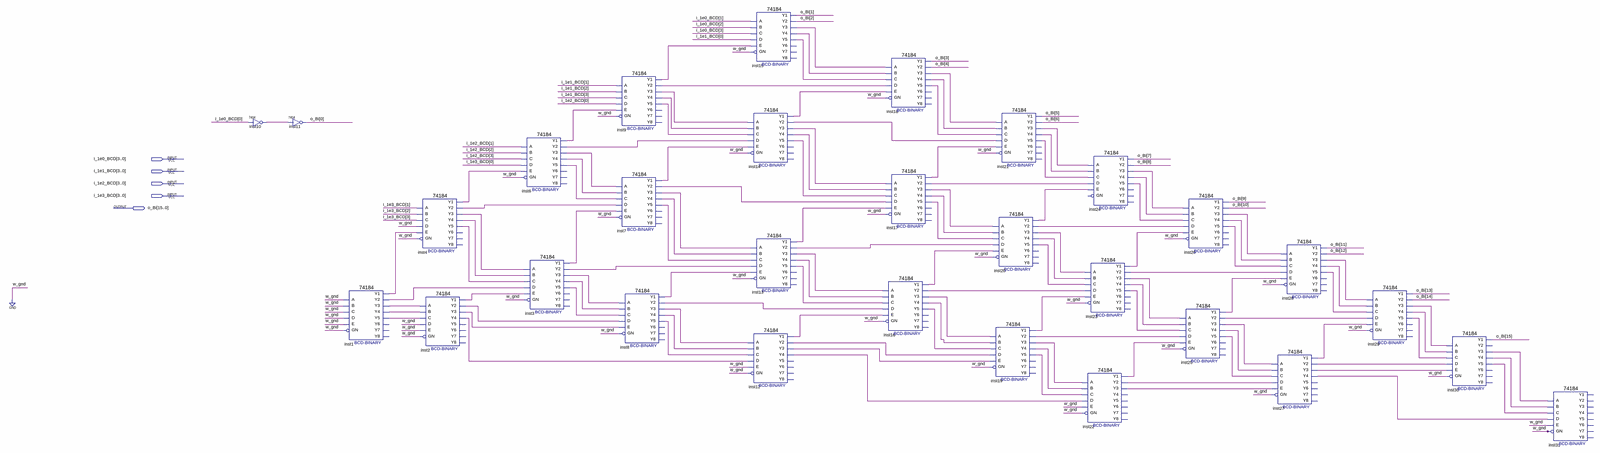
[diagram p0: schematic sheet, whole]
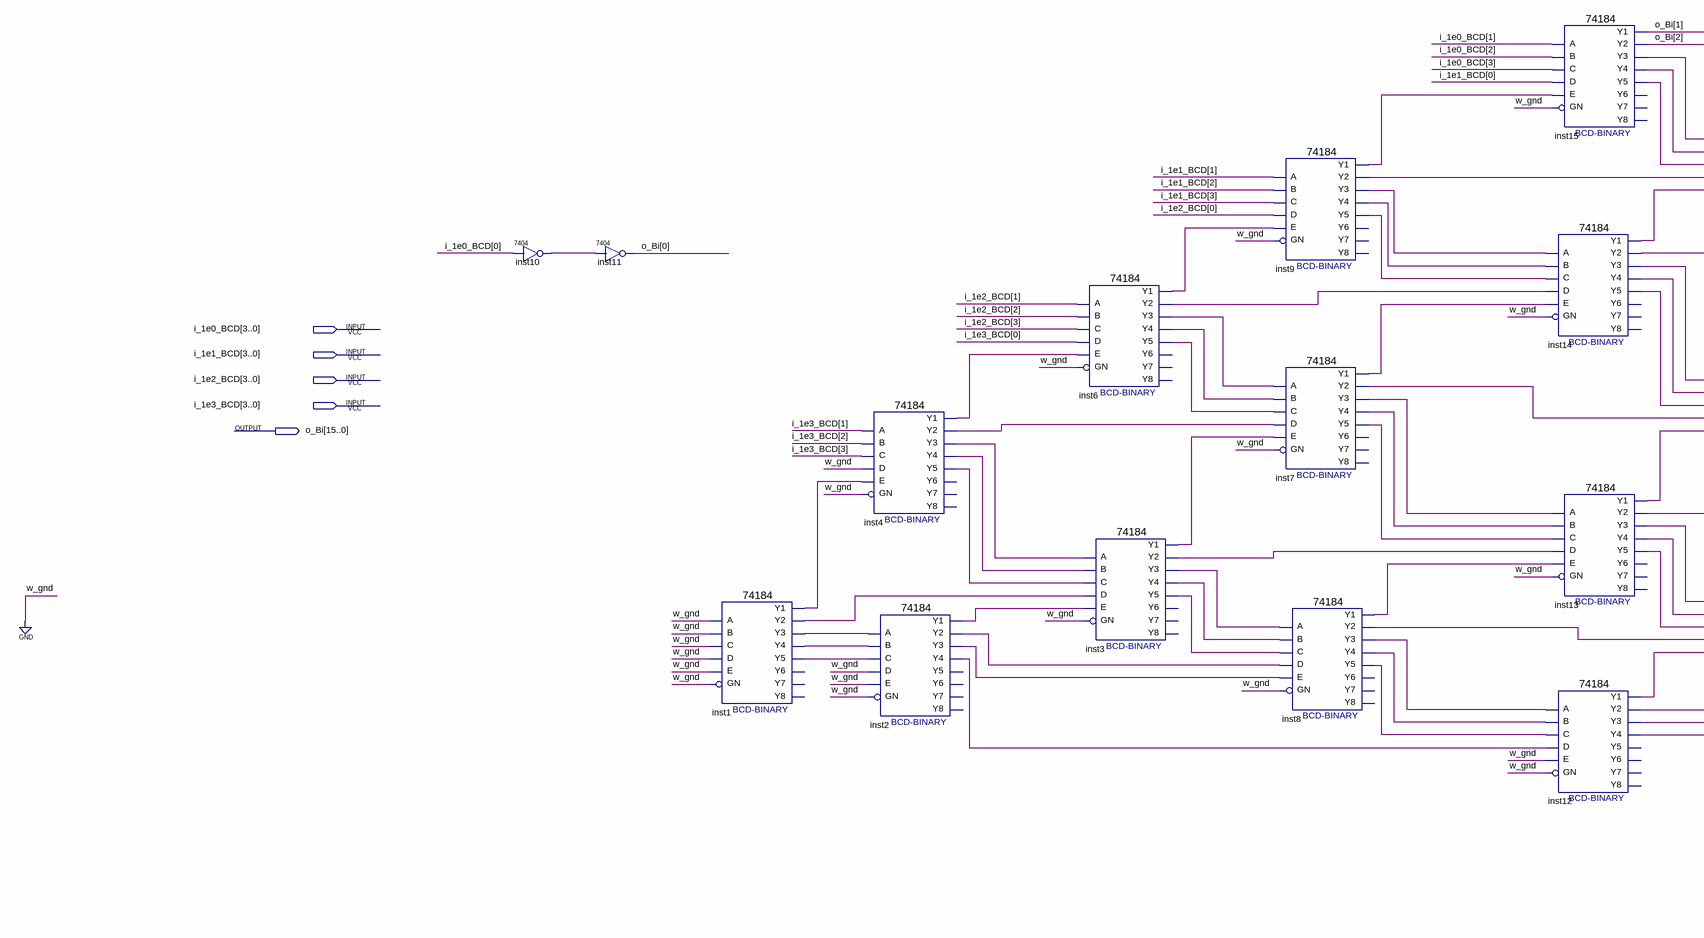
[diagram p1: schematic sheet, left part]
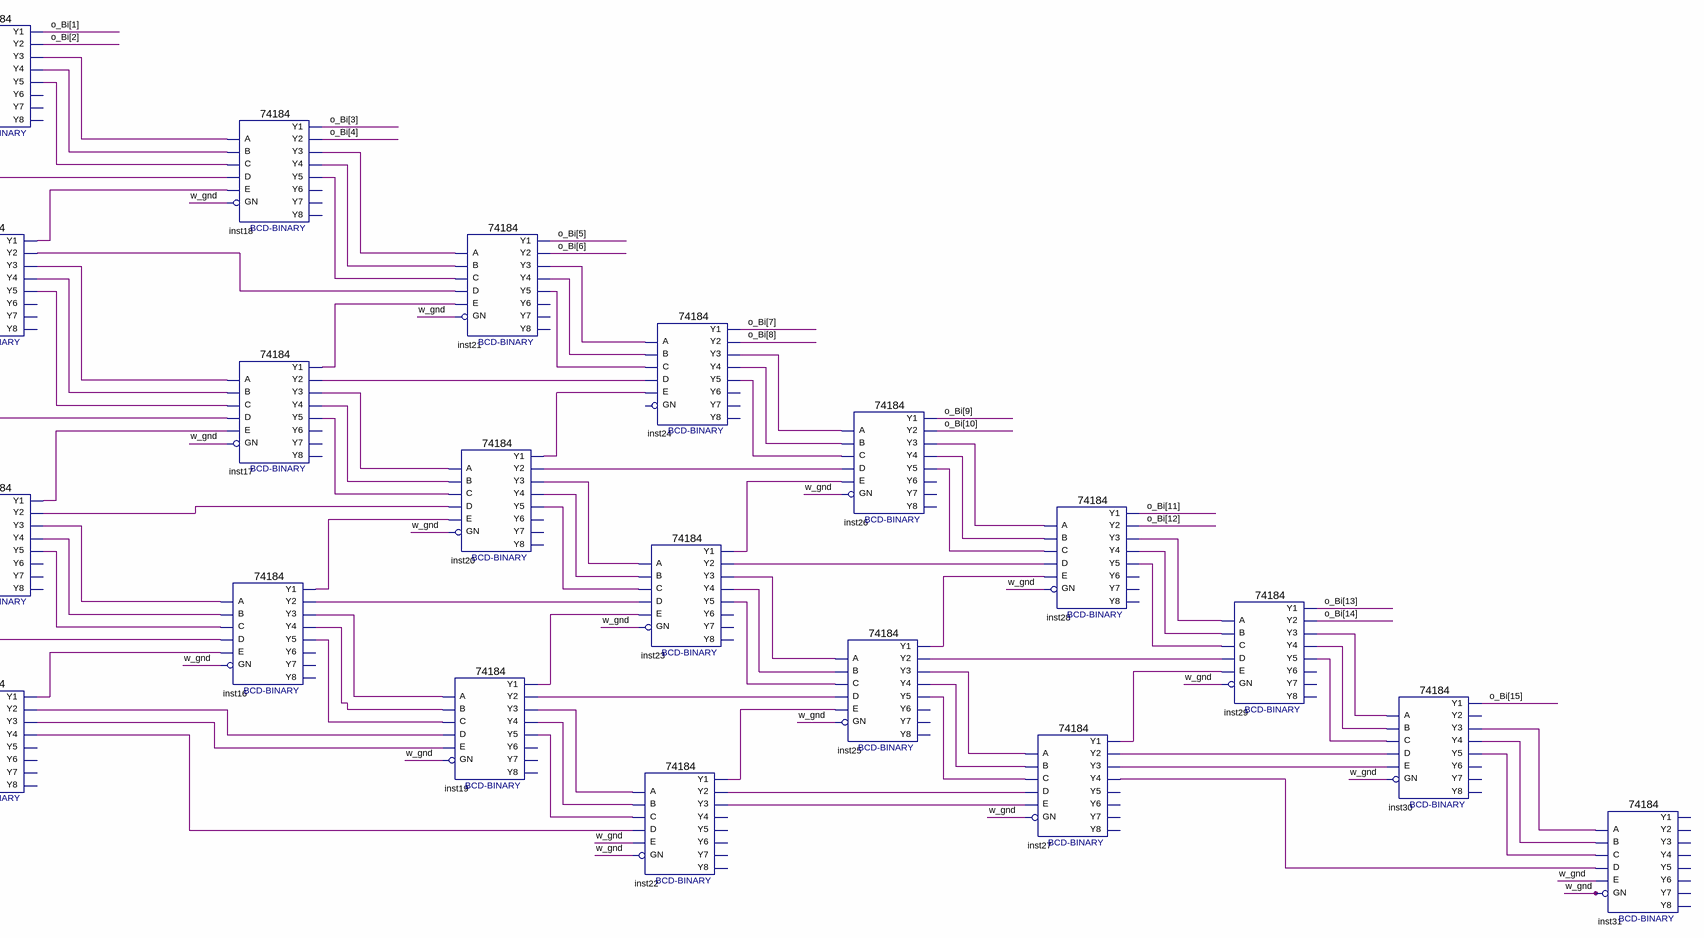
[diagram p2: schematic sheet, right part]
// Quartus schematic bcd_to_binary_1000.bdf as structural Verilog: 30 symbols, 5 pins
module bcd_to_binary_1000 (
  input  [3:0] i_1e0_BCD,
  input  [3:0] i_1e1_BCD,
  input  [3:0] i_1e2_BCD,
  input  [3:0] i_1e3_BCD,
  output [15:0] o_Bi
);

  wire inst1_y1, inst1_y2, inst1_y3, inst1_y4, inst1_y5, inst2_y1, inst2_y2, inst2_y3, inst2_y4, inst3_y1,
       inst3_y2, inst3_y3, inst3_y4, inst3_y5, inst4_y1, inst4_y2, inst4_y3, inst4_y4, inst4_y5, inst6_y1,
       inst6_y2, inst6_y3, inst6_y4, inst6_y5, inst7_y1, inst7_y2, inst7_y3, inst7_y4, inst7_y5, inst8_y1,
       inst8_y2, inst8_y3, inst8_y4, inst8_y5, inst9_y1, inst9_y2, inst9_y3, inst9_y4, inst9_y5, inst10_1,
       inst12_y1, inst12_y2, inst12_y3, inst12_y4, inst13_y1, inst13_y2, inst13_y3, inst13_y4, inst13_y5,
       inst14_y1, inst14_y2, inst14_y3, inst14_y4, inst14_y5, inst15_y3, inst15_y4, inst15_y5, inst16_y1,
       inst16_y2, inst16_y3, inst16_y4, inst16_y5, inst17_y1, inst17_y2, inst17_y3, inst17_y4, inst17_y5,
       inst18_y3, inst18_y4, inst18_y5, inst19_y1, inst19_y2, inst19_y3, inst19_y4, inst19_y5, inst20_y1,
       inst20_y2, inst20_y3, inst20_y4, inst20_y5, inst21_y3, inst21_y4, inst21_y5, inst22_y1, inst22_y2,
       inst22_y3, inst23_y1, inst23_y2, inst23_y3, inst23_y4, inst23_y5, inst24_y3, inst24_y4, inst24_y5,
       inst25_y1, inst25_y2, inst25_y3, inst25_y4, inst25_y5, inst26_y3, inst26_y4, inst26_y5, inst27_y1,
       inst27_y2, inst27_y3, inst27_y4, inst28_y3, inst28_y4, inst28_y5, inst29_y3, inst29_y4, inst29_y5,
       inst30_y3, inst30_y4, inst30_y5;

  \7404  inst10 (.\2 (i_1e0_BCD[0]), .\1 (inst10_1));
  \7404  inst11 (.\2 (inst10_1), .\1 (o_Bi[0]));
  \74184  inst1 (
    .D(1'b0), .A(1'b0), .B(1'b0), .C(1'b0), .E(1'b0), .GN(1'b0), .Y5(inst1_y5), .Y3(inst1_y3), .Y4(inst1_y4),
    .Y2(inst1_y2), .Y1(inst1_y1));  // open: Y6, Y7, Y8
  \74184  inst4 (
    .D(1'b0), .A(i_1e3_BCD[1]), .B(i_1e3_BCD[2]), .C(i_1e3_BCD[3]), .E(inst1_y1), .GN(1'b0), .Y5(inst4_y5),
    .Y3(inst4_y3), .Y4(inst4_y4), .Y2(inst4_y2), .Y1(inst4_y1));  // open: Y6, Y7, Y8
  \74184  inst2 (
    .D(1'b0), .A(inst1_y3), .B(inst1_y4), .C(inst1_y5), .E(1'b0), .GN(1'b0), .Y3(inst2_y3), .Y4(inst2_y4),
    .Y2(inst2_y2), .Y1(inst2_y1));  // open: Y5, Y6, Y7, Y8
  \74184  inst6 (
    .D(i_1e3_BCD[0]), .A(i_1e2_BCD[1]), .B(i_1e2_BCD[2]), .C(i_1e2_BCD[3]), .E(inst4_y1), .GN(1'b0),
    .Y5(inst6_y5), .Y3(inst6_y3), .Y4(inst6_y4), .Y2(inst6_y2), .Y1(inst6_y1));  // open: Y6, Y7, Y8
  \74184  inst3 (
    .D(inst1_y2), .A(inst4_y3), .B(inst4_y4), .C(inst4_y5), .E(inst2_y1), .GN(1'b0), .Y5(inst3_y5),
    .Y3(inst3_y3), .Y4(inst3_y4), .Y2(inst3_y2), .Y1(inst3_y1));  // open: Y6, Y7, Y8
  \74184  inst9 (
    .D(i_1e2_BCD[0]), .A(i_1e1_BCD[1]), .B(i_1e1_BCD[2]), .C(i_1e1_BCD[3]), .E(inst6_y1), .GN(1'b0),
    .Y5(inst9_y5), .Y3(inst9_y3), .Y4(inst9_y4), .Y2(inst9_y2), .Y1(inst9_y1));  // open: Y6, Y7, Y8
  \74184  inst7 (
    .D(inst4_y2), .A(inst6_y3), .B(inst6_y4), .C(inst6_y5), .E(inst3_y1), .GN(1'b0), .Y5(inst7_y5),
    .Y3(inst7_y3), .Y4(inst7_y4), .Y2(inst7_y2), .Y1(inst7_y1));  // open: Y6, Y7, Y8
  \74184  inst8 (
    .D(inst2_y2), .A(inst3_y3), .B(inst3_y4), .C(inst3_y5), .E(inst2_y3), .GN(1'b0), .Y5(inst8_y5),
    .Y3(inst8_y3), .Y4(inst8_y4), .Y2(inst8_y2), .Y1(inst8_y1));  // open: Y6, Y7, Y8
  \74184  inst15 (
    .D(i_1e1_BCD[0]), .A(i_1e0_BCD[1]), .B(i_1e0_BCD[2]), .C(i_1e0_BCD[3]), .E(inst9_y1), .GN(1'b0),
    .Y5(inst15_y5), .Y3(inst15_y3), .Y4(inst15_y4), .Y2(o_Bi[2]), .Y1(o_Bi[1]));  // open: Y6, Y7, Y8
  \74184  inst14 (
    .D(inst6_y2), .A(inst9_y3), .B(inst9_y4), .C(inst9_y5), .E(inst7_y1), .GN(1'b0), .Y5(inst14_y5),
    .Y3(inst14_y3), .Y4(inst14_y4), .Y2(inst14_y2), .Y1(inst14_y1));  // open: Y6, Y7, Y8
  \74184  inst13 (
    .D(inst3_y2), .A(inst7_y3), .B(inst7_y4), .C(inst7_y5), .E(inst8_y1), .GN(1'b0), .Y5(inst13_y5),
    .Y3(inst13_y3), .Y4(inst13_y4), .Y2(inst13_y2), .Y1(inst13_y1));  // open: Y6, Y7, Y8
  \74184  inst12 (
    .D(inst2_y4), .A(inst8_y3), .B(inst8_y4), .C(inst8_y5), .E(1'b0), .GN(1'b0), .Y3(inst12_y3),
    .Y4(inst12_y4), .Y2(inst12_y2), .Y1(inst12_y1));  // open: Y5, Y6, Y7, Y8
  \74184  inst18 (
    .D(inst9_y2), .A(inst15_y3), .B(inst15_y4), .C(inst15_y5), .E(inst14_y1), .GN(1'b0), .Y5(inst18_y5),
    .Y3(inst18_y3), .Y4(inst18_y4), .Y2(o_Bi[4]), .Y1(o_Bi[3]));  // open: Y6, Y7, Y8
  \74184  inst17 (
    .D(inst7_y2), .A(inst14_y3), .B(inst14_y4), .C(inst14_y5), .E(inst13_y1), .GN(1'b0), .Y5(inst17_y5),
    .Y3(inst17_y3), .Y4(inst17_y4), .Y2(inst17_y2), .Y1(inst17_y1));  // open: Y6, Y7, Y8
  \74184  inst16 (
    .D(inst8_y2), .A(inst13_y3), .B(inst13_y4), .C(inst13_y5), .E(inst12_y1), .GN(1'b0), .Y5(inst16_y5),
    .Y3(inst16_y3), .Y4(inst16_y4), .Y2(inst16_y2), .Y1(inst16_y1));  // open: Y6, Y7, Y8
  \74184  inst21 (
    .D(inst14_y2), .A(inst18_y3), .B(inst18_y4), .C(inst18_y5), .E(inst17_y1), .GN(1'b0), .Y5(inst21_y5),
    .Y3(inst21_y3), .Y4(inst21_y4), .Y2(o_Bi[6]), .Y1(o_Bi[5]));  // open: Y6, Y7, Y8
  \74184  inst20 (
    .D(inst13_y2), .A(inst17_y3), .B(inst17_y4), .C(inst17_y5), .E(inst16_y1), .GN(1'b0), .Y5(inst20_y5),
    .Y3(inst20_y3), .Y4(inst20_y4), .Y2(inst20_y2), .Y1(inst20_y1));  // open: Y6, Y7, Y8
  \74184  inst19 (
    .D(inst12_y2), .A(inst16_y3), .B(inst16_y4), .C(inst16_y5), .E(inst12_y3), .GN(1'b0), .Y5(inst19_y5),
    .Y3(inst19_y3), .Y4(inst19_y4), .Y2(inst19_y2), .Y1(inst19_y1));  // open: Y6, Y7, Y8
  \74184  inst24 (
    .D(inst17_y2), .A(inst21_y3), .B(inst21_y4), .C(inst21_y5), .E(inst20_y1), .Y5(inst24_y5),
    .Y3(inst24_y3), .Y4(inst24_y4), .Y2(o_Bi[8]), .Y1(o_Bi[7]));  // open: GN, Y6, Y7, Y8
  \74184  inst23 (
    .D(inst16_y2), .A(inst20_y3), .B(inst20_y4), .C(inst20_y5), .E(inst19_y1), .GN(1'b0), .Y5(inst23_y5),
    .Y3(inst23_y3), .Y4(inst23_y4), .Y2(inst23_y2), .Y1(inst23_y1));  // open: Y6, Y7, Y8
  \74184  inst22 (
    .D(inst12_y4), .A(inst19_y3), .B(inst19_y4), .C(inst19_y5), .E(1'b0), .GN(1'b0), .Y3(inst22_y3),
    .Y2(inst22_y2), .Y1(inst22_y1));  // open: Y5, Y4, Y6, Y7, Y8
  \74184  inst26 (
    .D(inst20_y2), .A(inst24_y3), .B(inst24_y4), .C(inst24_y5), .E(inst23_y1), .GN(1'b0), .Y5(inst26_y5),
    .Y3(inst26_y3), .Y4(inst26_y4), .Y2(o_Bi[10]), .Y1(o_Bi[9]));  // open: Y6, Y7, Y8
  \74184  inst25 (
    .D(inst19_y2), .A(inst23_y3), .B(inst23_y4), .C(inst23_y5), .E(inst22_y1), .GN(1'b0), .Y5(inst25_y5),
    .Y3(inst25_y3), .Y4(inst25_y4), .Y2(inst25_y2), .Y1(inst25_y1));  // open: Y6, Y7, Y8
  \74184  inst27 (
    .D(inst22_y2), .A(inst25_y3), .B(inst25_y4), .C(inst25_y5), .E(inst22_y3), .GN(1'b0), .Y3(inst27_y3),
    .Y4(inst27_y4), .Y2(inst27_y2), .Y1(inst27_y1));  // open: Y5, Y6, Y7, Y8
  \74184  inst28 (
    .D(inst23_y2), .A(inst26_y3), .B(inst26_y4), .C(inst26_y5), .E(inst25_y1), .GN(1'b0), .Y5(inst28_y5),
    .Y3(inst28_y3), .Y4(inst28_y4), .Y2(o_Bi[12]), .Y1(o_Bi[11]));  // open: Y6, Y7, Y8
  \74184  inst29 (
    .D(inst25_y2), .A(inst28_y3), .B(inst28_y4), .C(inst28_y5), .E(inst27_y1), .GN(1'b0), .Y5(inst29_y5),
    .Y3(inst29_y3), .Y4(inst29_y4), .Y2(o_Bi[14]), .Y1(o_Bi[13]));  // open: Y6, Y7, Y8
  \74184  inst30 (
    .D(inst27_y2), .A(inst29_y3), .B(inst29_y4), .C(inst29_y5), .E(inst27_y3), .GN(1'b0), .Y5(inst30_y5),
    .Y3(inst30_y3), .Y4(inst30_y4), .Y1(o_Bi[15]));  // open: Y2, Y6, Y7, Y8
  \74184  inst31 (
    .D(inst27_y4), .A(inst30_y3), .B(inst30_y4), .C(inst30_y5), .E(1'b0), .GN(1'b0));  // open: Y5, Y3, Y4, Y2, Y6, Y7, Y8, Y1
endmodule
